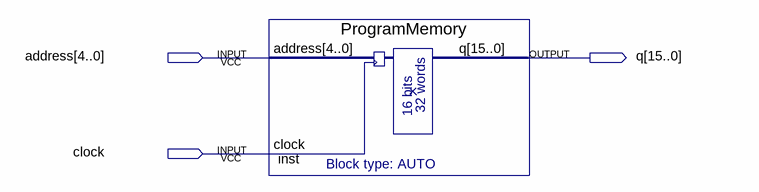
[diagram p0: schematic sheet]
// Quartus schematic TestMemoriaSemana4.bdf as structural Verilog: 1 symbols, 3 pins
module TestMemoriaSemana4 (
  input  [4:0] address,
  input  clock,
  output [15:0] q
);

  ProgramMemory inst (.address(address), .clock(clock), .q(q));
endmodule
